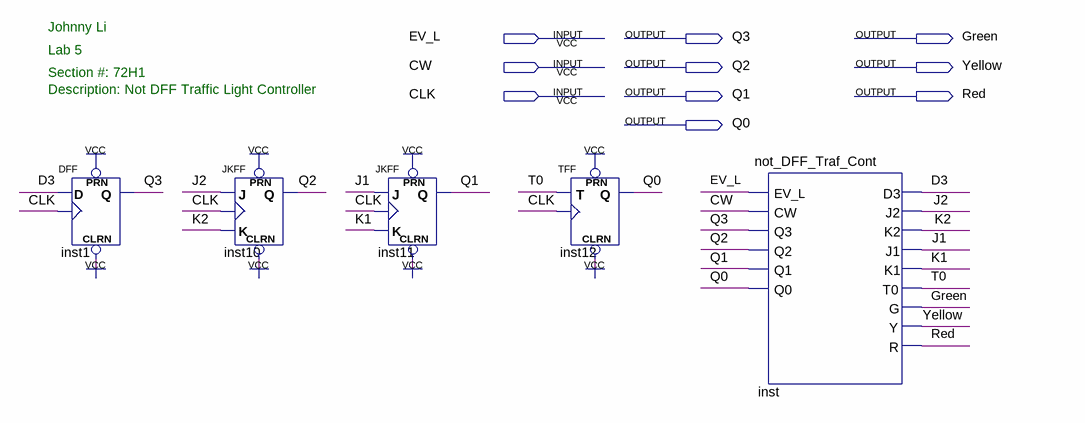
[diagram p0: schematic sheet]
// Quartus schematic Lab5_not_DFF_Traf_Cont.bdf as structural Verilog: 5 symbols, 10 pins
module Lab5_not_DFF_Traf_Cont (
  input  EV_L,
  input  CW,
  input  CLK,
  output Q3,
  output Green,
  output Q2,
  output Yellow,
  output Q1,
  output Red,
  output Q0
);

  wire D3, J1, J2, K1, K2, T0;

  DFF inst1 (.CLRN(1'b1), .CLK(CLK), .D(D3), .PRN(1'b1), .Q(Q3));
  JKFF inst10 (.PRN(1'b1), .CLRN(1'b1), .K(K2), .J(J2), .CLK(CLK), .Q(Q2));
  JKFF inst11 (.PRN(1'b1), .CLRN(1'b1), .K(K1), .J(J1), .CLK(CLK), .Q(Q1));
  TFF inst12 (.PRN(1'b1), .CLRN(1'b1), .T(T0), .CLK(CLK), .Q(Q0));
  not_DFF_Traf_Cont inst (
    .EV_L(EV_L), .CW(CW), .Q3(Q3), .Q2(Q2), .Q1(Q1), .Q0(Q0), .D3(D3), .J2(J2), .K2(K2), .J1(J1), .K1(K1),
    .T0(T0), .G(Green), .Y(Yellow), .R(Red));

  // Notes on the sheet:
  //   Johnny Li 
  //   Lab 5 
  //   Section #: 72H1
  //   Description: Not DFF Traffic Light Controller
endmodule
